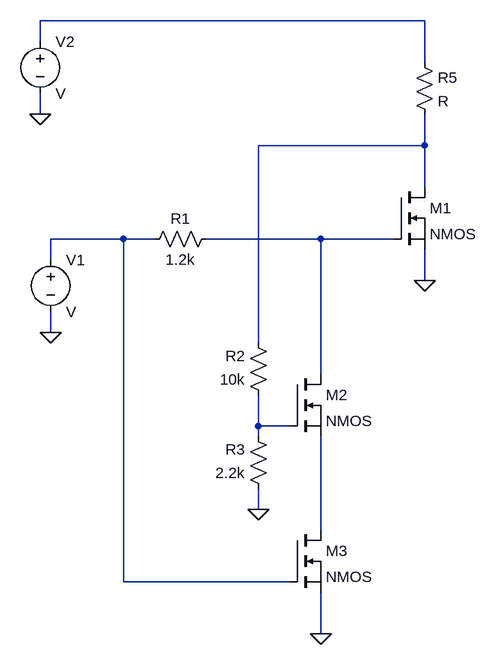
[diagram p0: schematic Draft1.asc]
Draft1.asc, the LTspice schematic file:
Version 4
SHEET 1 880 680
WIRE 512 -400 -80 -400
WIRE -80 -368 -80 -400
WIRE 512 -336 512 -400
WIRE -80 -256 -80 -288
WIRE 512 -208 512 -256
WIRE 512 -208 256 -208
WIRE 512 -144 512 -208
WIRE 48 -64 -64 -64
WIRE 96 -64 48 -64
WIRE 352 -64 176 -64
WIRE 464 -64 352 -64
WIRE -64 -32 -64 -64
WIRE 512 0 512 -48
WIRE -64 80 -64 48
WIRE 256 96 256 -208
WIRE 352 144 352 -64
WIRE 256 224 256 176
WIRE 304 224 256 224
WIRE 256 240 256 224
WIRE 256 352 256 320
WIRE 352 384 352 240
WIRE 48 464 48 -64
WIRE 304 464 48 464
WIRE 352 544 352 480
FLAG 512 0 0
FLAG 352 544 0
FLAG 256 352 0
FLAG -80 -256 0
FLAG -64 80 0
SYMBOL res 192 -80 R90
WINDOW 0 0 56 VBottom 2
WINDOW 3 32 56 VTop 2
SYMATTR InstName R1
SYMATTR Value 1.2k
SYMBOL res 272 192 R180
WINDOW 0 36 76 Left 2
WINDOW 3 36 40 Left 2
SYMATTR InstName R2
SYMATTR Value 10k
SYMBOL res 272 336 R180
WINDOW 0 36 76 Left 2
WINDOW 3 36 40 Left 2
SYMATTR InstName R3
SYMATTR Value 2.2k
SYMBOL nmos 464 -144 R0
SYMATTR InstName M1
SYMBOL voltage -64 -48 R0
SYMATTR InstName V1
SYMBOL voltage -80 -384 R0
SYMATTR InstName V2
SYMBOL res 496 -352 R0
SYMATTR InstName R5
SYMBOL nmos 304 144 R0
SYMATTR InstName M2
SYMBOL nmos 304 384 R0
SYMATTR InstName M3

The netlist it stands for:
* Draft1.asc
R1 N004 N003 1.2k
R2 N005 N002 10k
R3 0 N005 2.2k
M1 N002 N004 0 0 NMOS
V1 N003 0 V
V2 N001 0 V
R5 N001 N002 R
M2 N004 N005 N006 N006 NMOS
M3 N006 N003 0 0 NMOS
.model NMOS NMOS
.model PMOS PMOS
.lib standard.mos
.backanno
.end